# Altium schematic sheet Olfactometer.SchDoc
size A
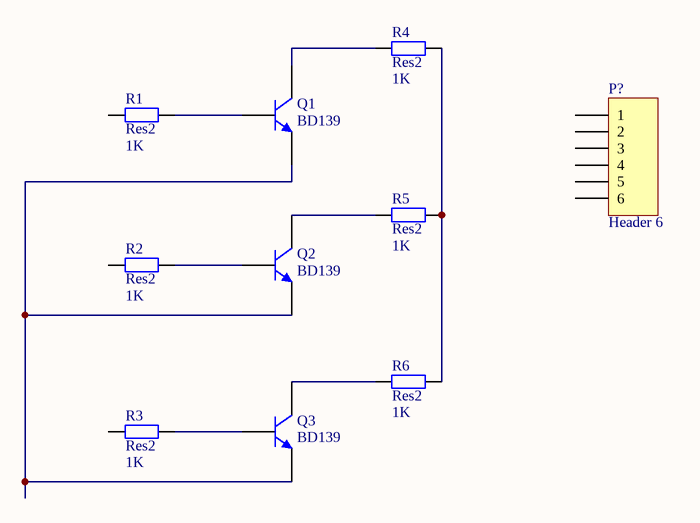
[diagram p0: Olfactometer.SchDoc]

## Parts
P?  Header 6  [HDR1X6]
Q1  BD139  [SOT-32]
Q2  BD139  [SOT-32]
Q3  BD139  [SOT-32]
R1  Res2  value 1K  [AXIAL-0.4]
R2  Res2  value 1K  [AXIAL-0.4]
R3  Res2  value 1K  [AXIAL-0.4]
R4  Res2  value 1K  [AXIAL-0.4]
R5  Res2  value 1K  [AXIAL-0.4]
R6  Res2  value 1K  [AXIAL-0.4]

## Nets
NetQ1_B: Q1.B R1.2
NetQ1_C: Q1.C R4.1
NetQ1_E: Q1.E Q2.E Q3.E
NetQ2_B: Q2.B R2.2
NetQ2_C: Q2.C R5.1
NetQ3_B: Q3.B R3.2
NetQ3_C: Q3.C R6.1
NetR4_2: R4.2 R5.2 R6.2

Not connected (* = marked no-connect by the designer): P? 1 2 3 4 5 6; R1 1; R2 1; R3 1

## Library data of the parts
P? = Header 6: Header, 6-Pin; LatestRevisionDate: 17-Jul-2002; LatestRevisionNote: Re-released for DXP Platform.; Publisher: Altium Limited
Q1-Q3 = BD139: NPN Transistor; E-mail: picpars@gmail.com; De: Seyed Mohsen Ghasemian; web: www.picpars.com
R1-R6 = Res2: Resistor; Published: 8-Jun-2000; LatestRevisionDate: 17-Jul-2002; LatestRevisionNote: Re-released for DXP Platform.; PackageReference: AXIAL-0.4; Publisher: Altium Limited; PackageDescription: Axial Device, Thru-Hole; 2 Leads; 0.4 in Pin Spacing